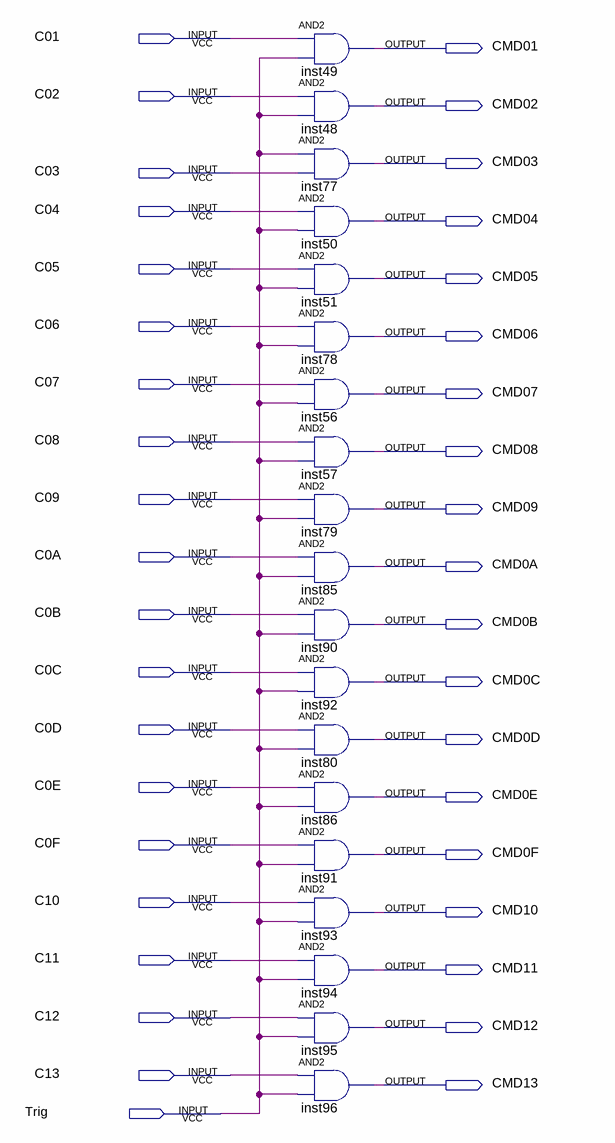
[diagram p0: schematic sheet]
// Quartus schematic CMD_trig.bdf as structural Verilog: 19 symbols, 39 pins
module CMD_trig (
  input  C01,
  input  C02,
  input  C03,
  input  C04,
  input  C05,
  input  C06,
  input  C07,
  input  C08,
  input  C09,
  input  C0A,
  input  C0B,
  input  C0C,
  input  C0D,
  input  C0E,
  input  C0F,
  input  C10,
  input  C11,
  input  C12,
  input  C13,
  input  Trig,
  output CMD01,
  output CMD02,
  output CMD03,
  output CMD04,
  output CMD05,
  output CMD06,
  output CMD07,
  output CMD08,
  output CMD09,
  output CMD0A,
  output CMD0B,
  output CMD0C,
  output CMD0D,
  output CMD0E,
  output CMD0F,
  output CMD10,
  output CMD11,
  output CMD12,
  output CMD13
);

  and inst49 (CMD01, C01, Trig);
  and inst48 (CMD02, C02, Trig);
  and inst77 (CMD03, Trig, C03);
  and inst50 (CMD04, C04, Trig);
  and inst51 (CMD05, C05, Trig);
  and inst78 (CMD06, C06, Trig);
  and inst56 (CMD07, C07, Trig);
  and inst57 (CMD08, C08, Trig);
  and inst79 (CMD09, C09, Trig);
  and inst85 (CMD0A, C0A, Trig);
  and inst90 (CMD0B, C0B, Trig);
  and inst92 (CMD0C, C0C, Trig);
  and inst80 (CMD0D, C0D, Trig);
  and inst86 (CMD0E, C0E, Trig);
  and inst91 (CMD0F, C0F, Trig);
  and inst93 (CMD10, C10, Trig);
  and inst94 (CMD11, C11, Trig);
  and inst95 (CMD12, C12, Trig);
  and inst96 (CMD13, C13, Trig);
endmodule
